# Altium project Kilobot_Controller.PrjPcb
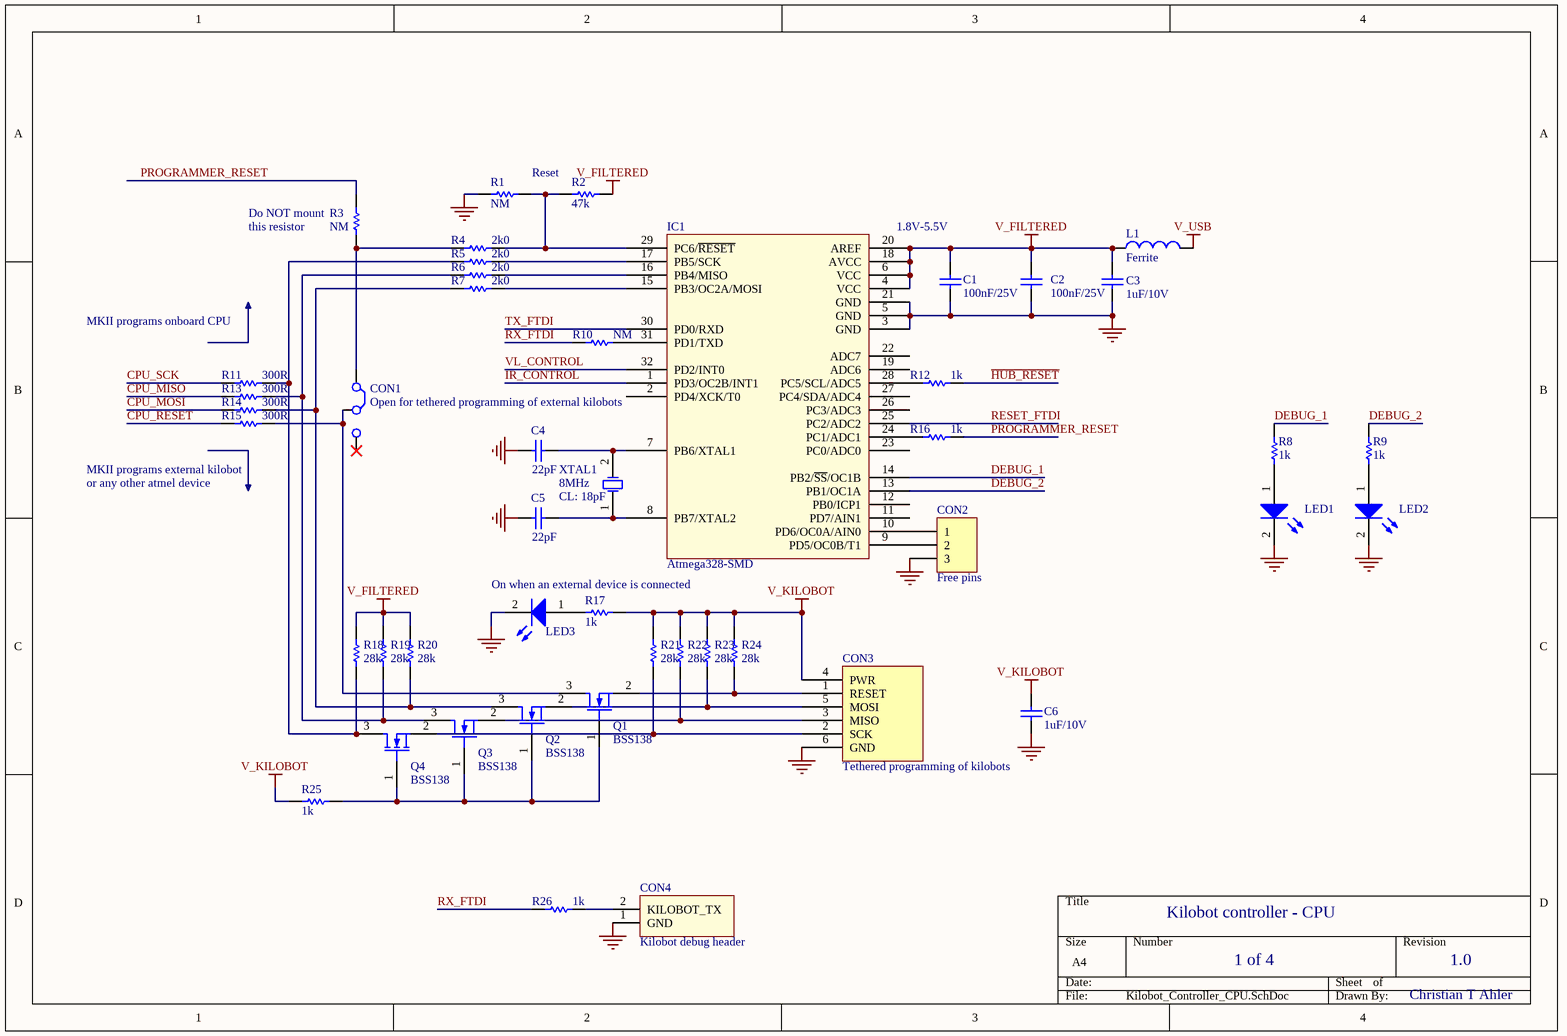
[diagram p0: Kilobot_Controller_CPU.SchDoc]
4 sheets, 142 parts. Net scope: global (net labels, ports and power ports of the same name join across sheets).
Board files: Kilobot_Controller_PCB.PcbDoc, Kilobot_Controller_PCB_Array.PcbDoc
Sheets:
  Kilobot_Controller_CPU.SchDoc
  Kilobot_Controller_IR.SchDoc
  Kilobot_Controller_ISP.SchDoc
  Kilobot_Controller_Hub&FTDI.SchDoc

## Sheet Kilobot_Controller_CPU.SchDoc
size A4; PageSetup: Record=PageOptions|CenterHorizontal=True|CenterVertical=True|PrintScale=1.00|XCorrection=1.00|YCorrection=1.00|PrintKind=1|BorderSize=5000000|LeftOffset=0|BottomOffset=0|Orientation=2|PaperLength=1000|PaperWidth=1000|Scale=100|PaperSource=15|PrintQuality=600|MediaType=1|DitherType=10|PaperKind=A4|PrintScaleMode=1

### Parts
C1  value 100nF/25V  [RESC1608L]  (hidden comment: C0603)
C2  value 100nF/25V  [RESC1608L]  (hidden comment: C0603)
C3  value 1uF/10V  [RESC1608L]  (hidden comment: C0603)
C4  value 22pF  [RESC1608L]  (hidden comment: C0603)
C5  value 22pF  [RESC1608L]  (hidden comment: C0603)
C6  value 1uF/10V  [RESC1608L]  (hidden comment: C0603)
CON1  (no value)  [HDR1X3]
CON2  Free pins  [HDR1X3]
CON3  Tethered programming of kilobots  [Programming]
CON4  Kilobot debug header  [HDR1X2]
IC1  Atmega328-SMD  [TQFP32]
L1  Ferrite  [RESC2012N]
LED1  LED  [LED0603]  (value not drawn)
LED2  LED  [LED0603]  (value not drawn)
LED3  LED  [LED0603]  (value not drawn)
Q1  value BSS138  [sot23-3]  (hidden comment: NMOS23)
Q2  value BSS138  [sot23-3]  (hidden comment: NMOS23)
Q3  value BSS138  [sot23-3]  (hidden comment: NMOS23)
Q4  value BSS138  [sot23-3]  (hidden comment: NMOS23)
R1  value NM  [RESC1608L]  (hidden comment: Res1)
R2  value 47k  [RESC1608L]  (hidden comment: Res1)
R3  value NM  [RESC1608L]  (hidden comment: Res1)
R4  value 2k0  [RESC1608L]  (hidden comment: Res1)
R5  value 2k0  [RESC1608L]  (hidden comment: Res1)
R6  value 2k0  [RESC1608L]  (hidden comment: Res1)
R7  value 2k0  [RESC1608L]  (hidden comment: Res1)
R8  value 1k  [RESC1608L]  (hidden comment: Res1)
R9  value 1k  [RESC1608L]  (hidden comment: Res1)
R10  value NM  [RESC1608L]  (hidden comment: Res1)
R11  value 300R  [RESC1608L]  (hidden comment: Res1)
R12  value 1k  [RESC1608L]  (hidden comment: Res1)
R13  value 300R  [RESC1608L]  (hidden comment: Res1)
R14  value 300R  [RESC1608L]  (hidden comment: Res1)
R15  value 300R  [RESC1608L]  (hidden comment: Res1)
R16  value 1k  [RESC1608L]  (hidden comment: Res1)
R17  value 1k  [RESC1608L]  (hidden comment: Res1)
R18  value 28k  [RESC1608L]  (hidden comment: Res1)
R19  value 28k  [RESC1608L]  (hidden comment: Res1)
R20  value 28k  [RESC1608L]  (hidden comment: Res1)
R21  value 28k  [RESC1608L]  (hidden comment: Res1)
R22  value 28k  [RESC1608L]  (hidden comment: Res1)
R23  value 28k  [RESC1608L]  (hidden comment: Res1)
R24  value 28k  [RESC1608L]  (hidden comment: Res1)
R25  value 1k  [RESC1608L]  (hidden comment: Res1)
R26  value 1k  [RESC1608L]  (hidden comment: Res1)
XTAL1  value 8MHz  CL: 18pF  [crystal-hc49]  (hidden comment: Crystal)

### Nets
GND: C1.2 C2.2 C3.1 C4.1 C5.1 C6.2 CON2.3 CON3.6(GND) CON4.1(GND) IC1.3(GND) IC1.5(GND) IC1.21(GND) LED1.2(K) LED2.2(K) LED3.2(K) R1.2
V_FILTERED: C1.1 C2.1 C3.2 IC1.4(VCC) IC1.6(VCC) IC1.18(AVCC) IC1.20(AREF) L1.1 R2.1 R18.2 R19.2 R20.2
V_KILOBOT: C6.1 CON3.4(PWR) R17.1 R21.2 R22.2 R23.2 R24.2 R25.1
V_USB: L1.2
CPU_MISO: R13.2
CPU_MOSI: R14.2
CPU_RESET: R15.2
CPU_SCK: R11.2
DEBUG_1: IC1.14(PB2/~{SS}/OC1B) R8.2
DEBUG_2: IC1.13(PB1/OC1A) R9.2
~{HUB_RESET}: R12.2
IR_CONTROL: IC1.1(PD3/OC2B/INT1)
PROGRAMMER_RESET: R3.2 R16.2
RESET_FTDI: IC1.25(PC2/ADC2)
RX_FTDI: R10.2 R26.2
TX_FTDI: IC1.30(PD0/RXD)
VL_CONTROL: IC1.32(PD2/INT0)
NetC4_2: C4.2 IC1.7(PB6/XTAL1) XTAL1.2(OSC2)
NetC5_2: C5.2 IC1.8(PB7/XTAL2) XTAL1.1(OSC1)
NetCON1_1: CON1.1(C1) R3.1 R4.2
NetCON1_2: CON1.2(C2) Q1.3(D) R15.1
NetCON2_1: CON2.1 IC1.10(PD6/OC0A/AIN0)
NetCON2_2: CON2.2 IC1.9(PD5/OC0B/T1)
NetCON3_1: CON3.1(RESET) Q1.2(S) R24.1
NetCON3_2: CON3.2(SCK) Q4.2(S) R21.1
NetCON3_3: CON3.3(MISO) Q3.2(S) R22.1
NetCON3_5: CON3.5(MOSI) Q2.2(S) R23.1
NetCON4_2: CON4.2(KILOBOT_TX) R26.1
NetIC1_15: IC1.15(PB3/OC2A/MOSI) R7.1
NetIC1_16: IC1.16(PB4/MISO) R6.1
NetIC1_17: IC1.17(PB5/SCK) R5.1
NetIC1_24: IC1.24(PC1/ADC1) R16.1
NetIC1_28: IC1.28(PC5/SCL/ADC5) R12.1
NetIC1_29: IC1.29(PC6/~{RESET}) R1.1 R2.2 R4.1
NetIC1_31: IC1.31(PD1/TXD) R10.1
NetLED1_1: LED1.1(A) R8.1
NetLED2_1: LED2.1(A) R9.1
NetLED3_1: LED3.1(A) R17.2
NetQ1_1: Q1.1(G) Q2.1(G) Q3.1(G) Q4.1(G) R25.2
NetQ2_3: Q2.3(D) R7.2 R14.1 R20.1
NetQ3_3: Q3.3(D) R6.2 R13.1 R19.1
NetQ4_3: Q4.3(D) R5.2 R11.1 R18.1

Not connected (* = marked no-connect by the designer): CON1 3(C3)*; IC1 2(PD4/XCK/T0) 11(PD7/AIN1) 12(PB0/ICP1) 19(ADC6) 22(ADC7) 23(PC0/ADC0) 26(PC3/ADC3) 27(PC4/SDA/ADC4)

### Notes on the sheet
- Reset
- (near R3) Do NOT mount
- (near R3) this resistor
- 1.8V-5.5V
- MKII programs onboard CPU
- (near IC1) Open for tethered programming of external kilobots
- MKII programs external kilobot
- or any other atmel device
- On when an external device is connected
- Kilobot controller - CPU
- 1 of 4
- 1.0
- Christian T Ahler

### Library data of the parts
C1 C2 = C0603: Ceramic Chip Capacitor - Standard; Order code: 445-1316-1-ND
C3 C6 = C0603: Ceramic Chip Capacitor - Standard; Order code: 445-1328-1-ND
C4 C5 = C0603: Ceramic Chip Capacitor - Standard; Order code: 445-1273-1-ND
CON1 = Jumper3: Value: Int/Ext programming; Order code: 3 pin jumper
CON2 = Header 3: Header, 3-Pin; Value: Free pins; Order code: Free pins
CON3 = Programming con new symbol: Value: Programming connector; Order code: 2x3 position pin header
CON4 = Kilobot_Debug_Header: Value: Debugging connector; Order code: 2 position pin header
IC1 = Atmega328-SMD: Order code: ATMEGA328-AU-ND; Value: Atmega328
L1 = Inductor: Value: 1k @ 100MHz; Order code: 445-5223-1-ND
LED1-LED3 = LED: Value: LED Green; Order code: 475-1409-1-ND
Q1-Q4 = NMOS23: Order code: BSS138KCT-ND
R1 R3 R10 = Res1: Resistor; Order code: DNO
R2 = Res1: Resistor; Order code: P47.0KHCT-ND
R4-R7 = Res1: Resistor; Order code: P2.0KGCT-ND
R8 R9 R12 R16 R17 R25 R26 = Res1: Resistor; Order code: P1.00KHCT-ND
R11 R13-R15 = Res1: Resistor; Order code: P300GCT-ND
R18-R24 = Res1: Resistor; Order code: P28.0KHCT-ND
XTAL1 = Crystal: Order code: 535-10212-1-ND

## Sheet Kilobot_Controller_IR.SchDoc
size A4
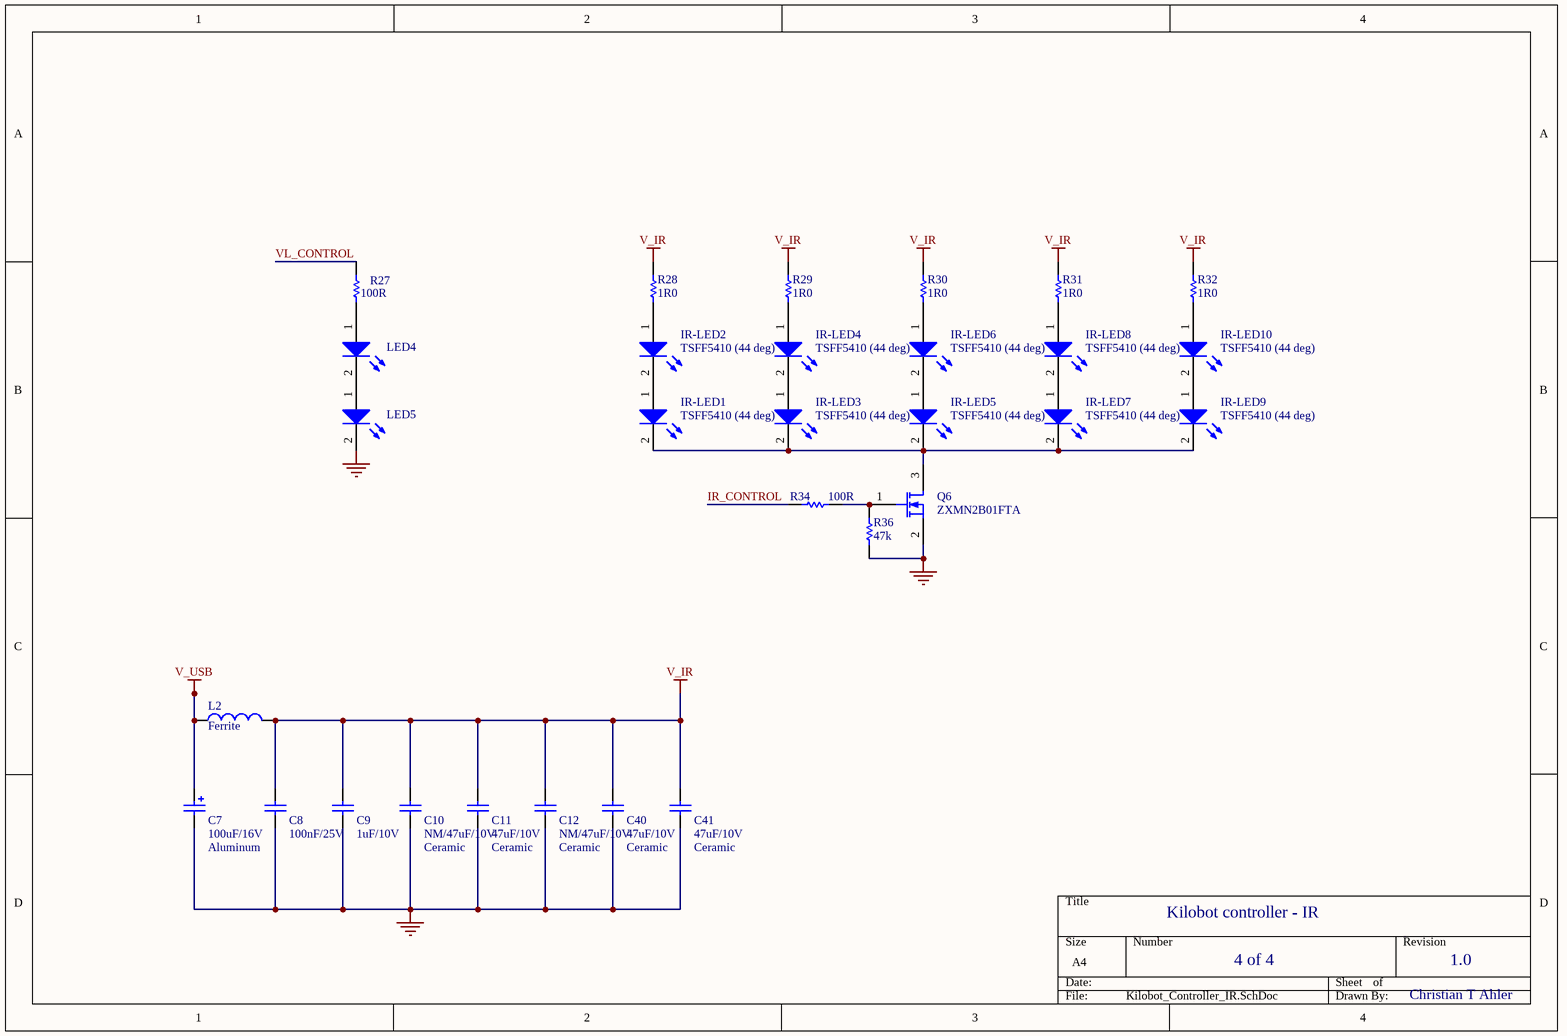
[diagram p1: Kilobot_Controller_IR.SchDoc]

### Parts
C7  Aluminum  value 100uF/16V  [cap5mm]
C8  value 100nF/25V  [RESC1608L]  (hidden comment: C0603)
C9  value 1uF/10V  [RESC1608L]  (hidden comment: C0603)
C10  Ceramic  value NM/47uF/10V  [8RB-1206]
C11  Ceramic  value 47uF/10V  [8RB-1206]
C12  Ceramic  value NM/47uF/10V  [8RB-1206]
C40  Ceramic  value 47uF/10V  [8RB-1206]
C41  Ceramic  value 47uF/10V  [8RB-1206]
IR-LED1  value TSFF5410 (44 deg)  [IR-LED]  (hidden comment: IR-LED)
IR-LED2  value TSFF5410 (44 deg)  [IR-LED]  (hidden comment: IR-LED)
IR-LED3  value TSFF5410 (44 deg)  [IR-LED]  (hidden comment: IR-LED)
IR-LED4  value TSFF5410 (44 deg)  [IR-LED]  (hidden comment: IR-LED)
IR-LED5  value TSFF5410 (44 deg)  [IR-LED]  (hidden comment: IR-LED)
IR-LED6  value TSFF5410 (44 deg)  [IR-LED]  (hidden comment: IR-LED)
IR-LED7  value TSFF5410 (44 deg)  [IR-LED]  (hidden comment: IR-LED)
IR-LED8  value TSFF5410 (44 deg)  [IR-LED]  (hidden comment: IR-LED)
IR-LED9  value TSFF5410 (44 deg)  [IR-LED]  (hidden comment: IR-LED)
IR-LED10  value TSFF5410 (44 deg)  [IR-LED]  (hidden comment: IR-LED)
L2  Ferrite  [RESC2012N]
LED4  LED  [LED0603]  (value not drawn)
LED5  LED  [LED0603]  (value not drawn)
Q6  value ZXMN2B01FTA  [sot23-3]  (hidden comment: NMOS23)
R27  value 100R  [RESC1608L]  (hidden comment: Res1)
R28  value 1R0  [RESC2012L]  (hidden comment: Res1)
R29  value 1R0  [RESC2012L]  (hidden comment: Res1)
R30  value 1R0  [RESC2012L]  (hidden comment: Res1)
R31  value 1R0  [RESC2012L]  (hidden comment: Res1)
R32  value 1R0  [RESC2012L]  (hidden comment: Res1)
R34  value 100R  [RESC1608L]  (hidden comment: Res1)
R36  value 47k  [RESC1608L]  (hidden comment: Res1)

### Nets
GND: C7.2 C8.2 C9.1 C10.1 C11.1 C12.1 C40.1 C41.1 LED5.2(K) Q6.2(S) R36.1
V_IR: C8.1 C9.2 C10.2 C11.2 C12.2 C40.2 C41.2 L2.2 R28.2 R29.2 R30.2 R31.2 R32.2
V_USB: C7.1 L2.1
IR_CONTROL: R34.2
VL_CONTROL: R27.2
NetIR-LED1_1: IR-LED1.1(A) IR-LED2.2(K)
NetIR-LED1_2: IR-LED1.2(K) IR-LED3.2(K) IR-LED5.2(K) IR-LED7.2(K) IR-LED9.2(K) Q6.3(D)
NetIR-LED2_1: IR-LED2.1(A) R28.1
NetIR-LED3_1: IR-LED3.1(A) IR-LED4.2(K)
NetIR-LED4_1: IR-LED4.1(A) R29.1
NetIR-LED5_1: IR-LED5.1(A) IR-LED6.2(K)
NetIR-LED6_1: IR-LED6.1(A) R30.1
NetIR-LED7_1: IR-LED7.1(A) IR-LED8.2(K)
NetIR-LED8_1: IR-LED8.1(A) R31.1
NetIR-LED9_1: IR-LED9.1(A) IR-LED10.2(K)
NetIR-LED10_1: IR-LED10.1(A) R32.1
NetLED4_1: LED4.1(A) R27.1
NetLED4_2: LED4.2(K) LED5.1(A)
NetQ6_1: Q6.1(G) R34.1 R36.2

### Notes on the sheet
- Kilobot controller - IR
- 4 of 4
- 1.0
- Christian T Ahler

### Library data of the parts
C7 = CAP: Order code: 493-1040-ND
C8 = C0603: as C1 on sheet Kilobot_Controller_CPU
C9 = C0603: as C3 on sheet Kilobot_Controller_CPU
C10 C12 = CAP2220: Order code: DNO
C11 C40 C41 = CAP2220: Order code: 490-3907-1-ND
IR-LED1-IR-LED10 = IR-LED: Order code: 751-1208-ND
L2 = Inductor: as L1 on sheet Kilobot_Controller_CPU
LED4 LED5 = LED: Value: LED Blue; Order code: LNJ937W8CRACT-ND
Q6 = NMOS23: Order code: ZXMN2B01FCT-ND; Alternative: SI2302ADS-T1-E3CT-ND
R27 R34 = Res1: Resistor; Order code: P100HCT-ND
R28-R32 = Res1: Resistor; Order code: RMCF0805JT1R00CT-ND
R36 = Res1: Resistor; Order code: P47.0KHCT-ND

## Sheet Kilobot_Controller_ISP.SchDoc
size A4
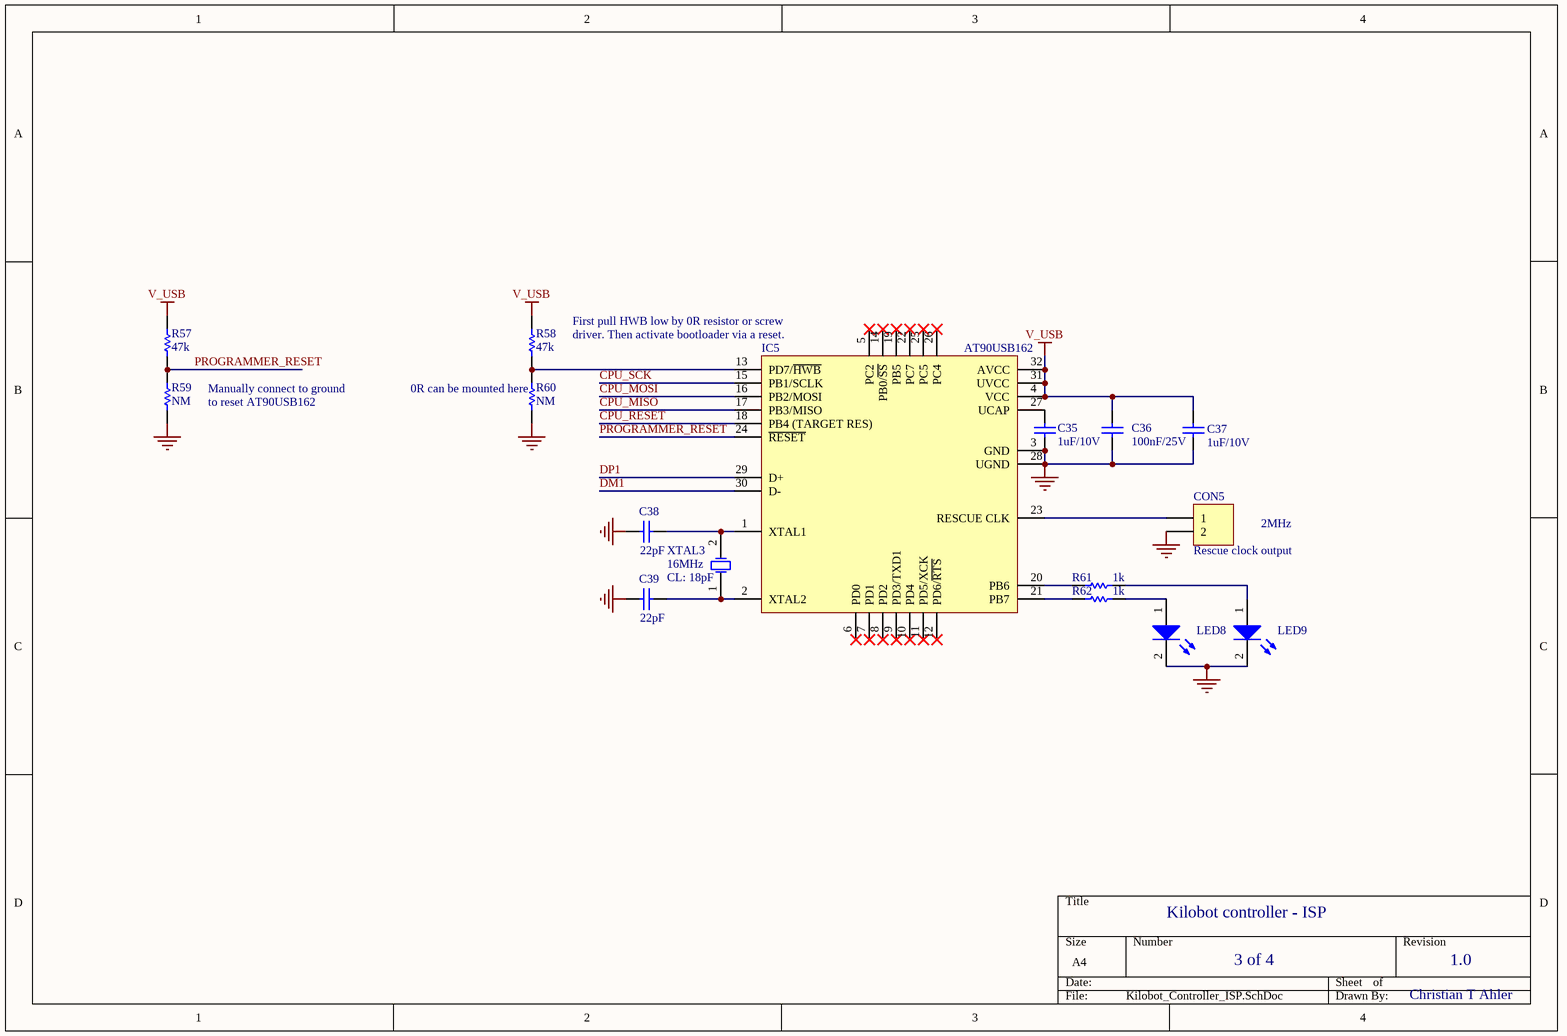
[diagram p2: Kilobot_Controller_ISP.SchDoc]

### Parts
C35  value 1uF/10V  [RESC1608L]  (hidden comment: C0603)
C36  value 100nF/25V  [RESC1608L]  (hidden comment: C0603)
C37  value 1uF/10V  [RESC1608L]  (hidden comment: C0603)
C38  value 22pF  [RESC1608L]  (hidden comment: C0603)
C39  value 22pF  [RESC1608L]  (hidden comment: C0603)
CON5  Rescue clock output  [HDR1X2]
IC5  AT90USB162  [TQFP32]
LED8  LED  [LED0603]  (value not drawn)
LED9  LED  [LED0603]  (value not drawn)
R57  value 47k  [RESC1608L]  (hidden comment: Res1)
R58  value 47k  [RESC1608L]  (hidden comment: Res1)
R59  value NM  [RESC1608L]  (hidden comment: Res1)
R60  value NM  [RESC1608L]  (hidden comment: Res1)
R61  value 1k  [RESC1608L]  (hidden comment: Res1)
R62  value 1k  [RESC1608L]  (hidden comment: Res1)
XTAL3  value 16MHz  CL: 18pF  [crystal-hc49]  (hidden comment: Crystal)

### Nets
GND: C35.1 C36.2 C37.1 C38.1 C39.1 CON5.2 IC5.3(GND) IC5.28(UGND) LED8.2(K) LED9.2(K) R59.2 R60.2
V_USB: C36.1 C37.2 IC5.4(VCC) IC5.31(UVCC) IC5.32(AVCC) R57.1 R58.1
CPU_MISO: IC5.17(PB3/MISO)
CPU_MOSI: IC5.16(PB2/MOSI)
CPU_RESET: IC5.18(PB4_(TARGET_RES))
CPU_SCK: IC5.15(PB1/SCLK)
DM1: IC5.30(D-)
DP1: IC5.29(D+)
PROGRAMMER_RESET: IC5.24(~{RESET}) R57.2 R59.1
NetC35_2: C35.2 IC5.27(UCAP)
NetC38_2: C38.2 IC5.1(XTAL1) XTAL3.2(OSC2)
NetC39_2: C39.2 IC5.2(XTAL2) XTAL3.1(OSC1)
NetCON5_1: CON5.1 IC5.23(RESCUE_CLK)
NetIC5_13: IC5.13(PD7/~{HWB}) R58.2 R60.1
NetIC5_20: IC5.20(PB6) R61.2
NetIC5_21: IC5.21(PB7) R62.2
NetLED8_1: LED8.1(A) R62.1
NetLED9_1: LED9.1(A) R61.1

Not connected (* = marked no-connect by the designer): IC5 5(PC2)* 6(PD0)* 7(PD1)* 8(PD2)* 9(PD3/TXD1)* 10(PD4)* 11(PD5/XCK)* 12(PD6/~{RTS})* 14(PB0/~{SS})* 19(PB5)* 22(PC7)* 25(PC5)* 26(PC4)*

### Notes on the sheet
- First pull HWB low by 0R resistor or screw
- (near IC5) driver. Then activate bootloader via a reset.
- Manually connect to ground
- to reset AT90USB162
- (near R60) 0R can be mounted here
- 2MHz
- Kilobot controller - ISP
- 3 of 4
- 1.0
- Christian T Ahler

### Library data of the parts
C35 C37 = C0603: as C3 on sheet Kilobot_Controller_CPU
C36 = C0603: as C1 on sheet Kilobot_Controller_CPU
C38 C39 = C0603: as C4 on sheet Kilobot_Controller_CPU
CON5 = Header 2: Header, 2-Pin; Order code: 2 position pin header; Value: Rescue clock output
IC5 = AT90USB162: Order code: AT90USB162-16AU-ND; Value: AT90USB162
LED8 LED9 = LED: as LED1 on sheet Kilobot_Controller_CPU
R57 R58 = Res1: Resistor; Order code: P47.0KHCT-ND
R59 R60 = Res1: Resistor; Order code: DNO
R61 R62 = Res1: Resistor; Order code: P1.00KHCT-ND
XTAL3 = Crystal: Order code: 535-10226-1-ND

## Sheet Kilobot_Controller_Hub&FTDI.SchDoc
size A4; PageSetup: Record=PageOptions|CenterHorizontal=True|CenterVertical=True|PrintScale=0.94|XCorrection=1.00|YCorrection=1.00|PrintKind=1|BorderSize=5000000|LeftOffset=0|BottomOffset=0|Orientation=2|PaperLength=1000|PaperWidth=1000|Scale=100|PaperSource=15|PrintQuality=600|MediaType=1|DitherType=10|PaperKind=Letter|PrintScaleMode=1
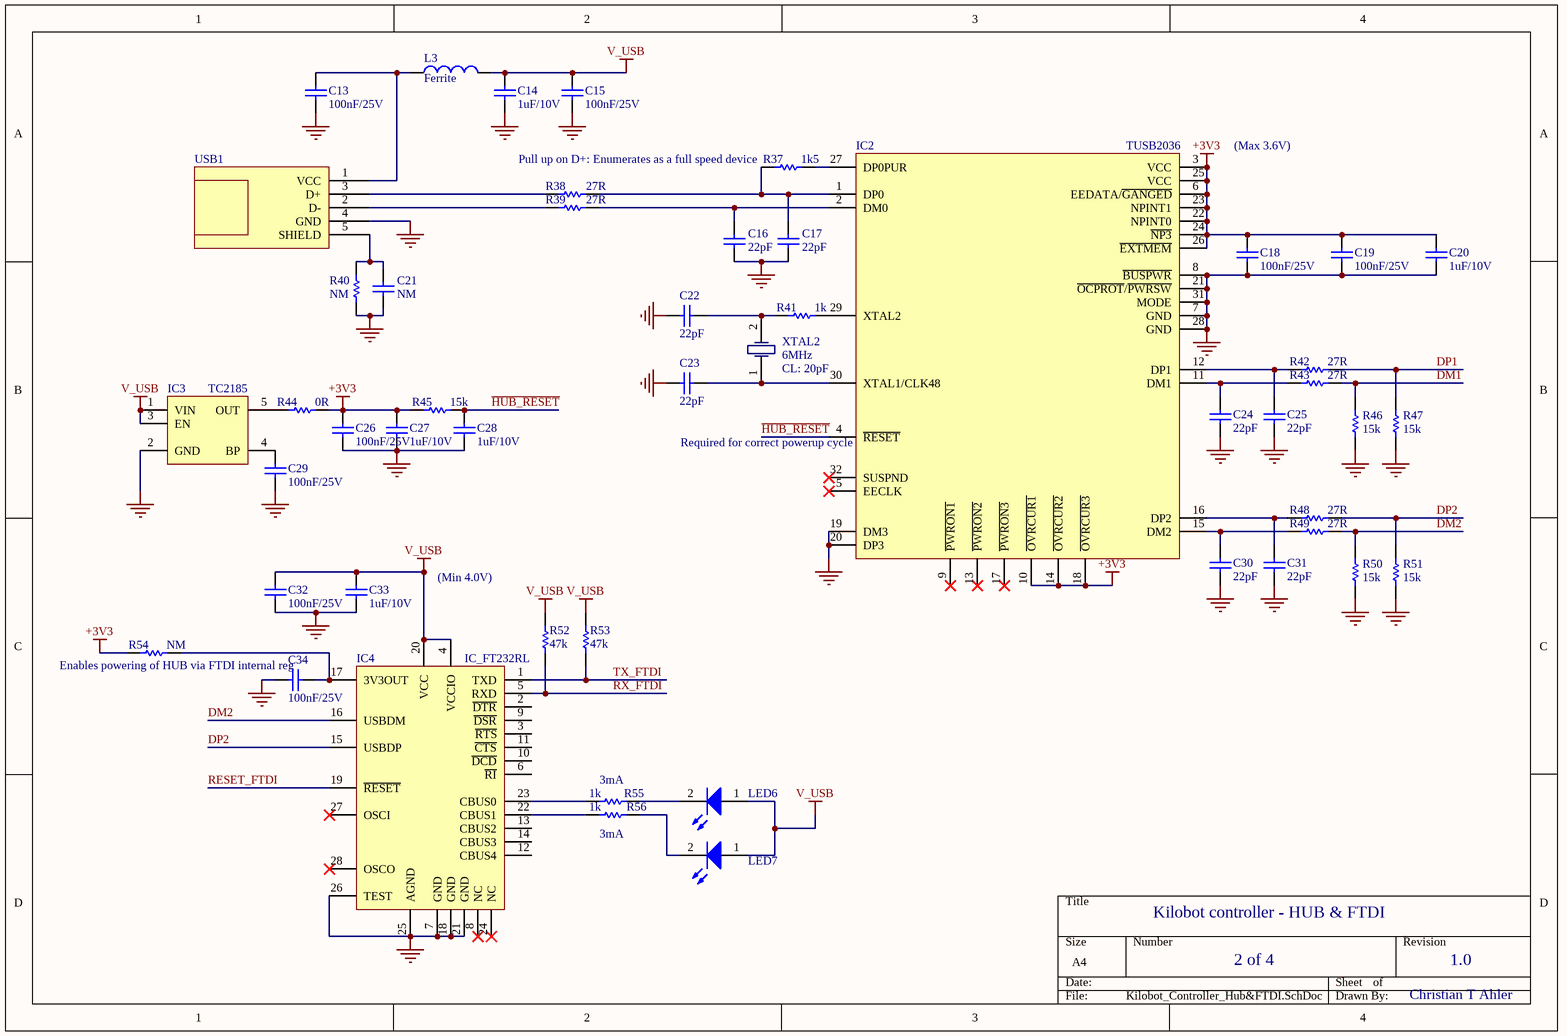
[diagram p3: Kilobot_Controller_Hub&FTDI.SchDoc]

### Parts
C13  value 100nF/25V  [RESC1608L]  (hidden comment: C0603)
C14  value 1uF/10V  [RESC1608L]  (hidden comment: C0603)
C15  value 100nF/25V  [RESC1608L]  (hidden comment: C0603)
C16  value 22pF  [RESC1608L]  (hidden comment: C0603)
C17  value 22pF  [RESC1608L]  (hidden comment: C0603)
C18  value 100nF/25V  [RESC1608L]  (hidden comment: C0603)
C19  value 100nF/25V  [RESC1608L]  (hidden comment: C0603)
C20  value 1uF/10V  [RESC1608L]  (hidden comment: C0603)
C21  value NM  [RESC1608L]  (hidden comment: C0603)
C22  value 22pF  [RESC1608L]  (hidden comment: C0603)
C23  value 22pF  [RESC1608L]  (hidden comment: C0603)
C24  value 22pF  [RESC1608L]  (hidden comment: C0603)
C25  value 22pF  [RESC1608L]  (hidden comment: C0603)
C26  value 100nF/25V  [RESC1608L]  (hidden comment: C0603)
C27  value 1uF/10V  [RESC1608L]  (hidden comment: C0603)
C28  value 1uF/10V  [RESC1608L]  (hidden comment: C0603)
C29  value 100nF/25V  [RESC1608L]  (hidden comment: C0603)
C30  value 22pF  [RESC1608L]  (hidden comment: C0603)
C31  value 22pF  [RESC1608L]  (hidden comment: C0603)
C32  value 100nF/25V  [RESC1608L]  (hidden comment: C0603)
C33  value 1uF/10V  [RESC1608L]  (hidden comment: C0603)
C34  value 100nF/25V  [RESC1608L]  (hidden comment: C0603)
IC2  TUSB2036  [TQFP32]
IC3  TC2185  [SOT23-5]
IC4  IC_FT232RL  [SSOP-28]
L3  Ferrite  [RESC2012N]
LED6  LED  [LED0603]  (value not drawn)
LED7  LED  [LED0603]  (value not drawn)
R37  value 1k5  [RESC1608L]  (hidden comment: Res1)
R38  value 27R  [RESC1608L]  (hidden comment: Res1)
R39  value 27R  [RESC1608L]  (hidden comment: Res1)
R40  value NM  [RESC1608L]  (hidden comment: Res1)
R41  value 1k  [RESC1608L]  (hidden comment: Res1)
R42  value 27R  [RESC1608L]  (hidden comment: Res1)
R43  value 27R  [RESC1608L]  (hidden comment: Res1)
R44  value 0R  [RESC1608L]  (hidden comment: Res1)
R45  value 15k  [RESC1608L]  (hidden comment: Res1)
R46  value 15k  [RESC1608L]  (hidden comment: Res1)
R47  value 15k  [RESC1608L]  (hidden comment: Res1)
R48  value 27R  [RESC1608L]  (hidden comment: Res1)
R49  value 27R  [RESC1608L]  (hidden comment: Res1)
R50  value 15k  [RESC1608L]  (hidden comment: Res1)
R51  value 15k  [RESC1608L]  (hidden comment: Res1)
R52  value 47k  [RESC1608L]  (hidden comment: Res1)
R53  value 47k  [RESC1608L]  (hidden comment: Res1)
R54  value NM  [RESC1608L]  (hidden comment: Res1)
R55  value 1k  [RESC1608L]  (hidden comment: Res1)
R56  value 1k  [RESC1608L]  (hidden comment: Res1)
USB1  USB  [USB_Vertical]  (value not drawn)
XTAL2  value 6MHz  CL: 20pF  [CrystalSMD]  (hidden comment: CrystalSMD)

### Nets
+3V3: C18.2 C19.2 C20.2 C26.2 C27.2 IC2.3(VCC) IC2.6(EEDATA/~{GANGED}) IC2.10(~{OVRCUR1}) IC2.14(~{OVRCUR2}) IC2.18(~{OVRCUR3}) IC2.22(NPINT0) IC2.23(NPINT1) IC2.24(~{NP3}) IC2.25(VCC) IC2.26(~{EXTMEM}) R44.1 R45.2 R54.2
GND: C13.1 C14.2 C15.1 C16.1 C17.1 C18.1 C19.1 C20.1 C21.2 C22.1 C23.1 C24.1 C25.1 C26.1 C27.1 C28.1 C29.2 C30.1 C31.1 C32.2 C33.1 C34.2 IC2.7(GND) IC2.8(~{BUSPWR}) IC2.19(DM3) IC2.20(DP3) IC2.21(~{OCPROT}/~{PWRSW}) IC2.28(GND) IC2.31(MODE) IC3.2(GND) IC4.7(GND) IC4.18(GND) IC4.21(GND) IC4.25(AGND) IC4.26(TEST) R40.2 R46.2 R47.2 R50.2 R51.2 USB1.4(GND)
V_USB: C14.1 C15.2 C32.1 C33.2 IC3.1(VIN) IC3.3(EN) IC4.4(VCCIO) IC4.20(VCC) L3.2 LED6.1(A) LED7.1(A) R52.2 R53.2
DM1: R43.1 R46.1
DM2: IC4.16(USBDM) R49.1 R50.1
DP1: R42.1 R47.1
DP2: IC4.15(USBDP) R48.1 R51.1
~{HUB_RESET}: C28.2 IC2.4(~{RESET}) R45.1
RESET_FTDI: IC4.19(~{RESET})
RX_FTDI: IC4.5(RXD) R52.1
TX_FTDI: IC4.1(TXD) R53.1
NetC13_2: C13.2 L3.1 USB1.1(VCC)
NetC16_2: C16.2 IC2.2(DM0) R39.1
NetC17_2: C17.2 IC2.1(DP0) R37.2 R38.1
NetC21_1: C21.1 R40.1 USB1.5(SHIELD)
NetC22_2: C22.2 R41.2 XTAL2.2
NetC23_2: C23.2 IC2.30(XTAL1/CLK48) XTAL2.1
NetC24_2: C24.2 IC2.11(DM1) R43.2
NetC25_2: C25.2 IC2.12(DP1) R42.2
NetC29_1: C29.1 IC3.4(BP)
NetC30_2: C30.2 IC2.15(DM2) R49.2
NetC31_2: C31.2 IC2.16(DP2) R48.2
NetC34_1: C34.1 IC4.17(3V3OUT) R54.1
NetIC2_27: IC2.27(DP0PUR) R37.1
NetIC2_29: IC2.29(XTAL2) R41.1
NetIC3_5: IC3.5(OUT) R44.2
NetIC4_22: IC4.22(CBUS1) R56.1
NetIC4_23: IC4.23(CBUS0) R55.1
NetLED6_2: LED6.2(K) R55.2
NetLED7_2: LED7.2(K) R56.2
NetR38_2: R38.2 USB1.3(D+)
NetR39_2: R39.2 USB1.2(D-)

Not connected (* = marked no-connect by the designer): IC2 5(EECLK)* 9(~{PWRON1})* 13(~{PWRON2})* 17(~{PWRON3})* 32(SUSPND)*; IC4 2(~{DTR}) 3(~{RTS}) 6(~{RI}) 8(NC)* 9(~{DSR}) 10(~{DCD}) 11(~{CTS}) 12(CBUS4) 13(CBUS2) 14(CBUS3) 24(NC)* 27(OSCI)* 28(OSCO)*

### Notes on the sheet
- (near R37) Pull up on D+: Enumerates as a full speed device
- (Max 3.6V)
- (near IC2) Required for correct powerup cycle
- (Min 4.0V)
- Enables powering of HUB via FTDI internal reg
- (near R55) 3mA
- (near R56) 3mA
- Kilobot controller - HUB & FTDI
- 2 of 4
- 1.0
- Christian T Ahler

### Library data of the parts
C13 C15 C18 C19 C26 C29 C32 C34 = C0603: as C1 on sheet Kilobot_Controller_CPU
C14 C20 C27 C28 C33 = C0603: as C3 on sheet Kilobot_Controller_CPU
C16 C17 C22-C25 C30 C31 = C0603: as C4 on sheet Kilobot_Controller_CPU
C21 = C0603: Ceramic Chip Capacitor - Standard; Order code: DNO
IC2 = TUSB2036: Order code: 296-27129-1-ND; Value: TUSB2036
IC3 = TC2185: Value: LDO; Order code: TC2185-3.3VCCT-ND
IC4 = IC_FT232RL: FT232R USB UART; Value: FTDI USB; Order code: 768-1007-1-ND
L3 = Inductor: as L1 on sheet Kilobot_Controller_CPU
LED6 LED7 = LED: as LED1 on sheet Kilobot_Controller_CPU
R37 = Res1: Resistor; Order code: P1.5KGCT-ND
R38 R39 R42 R43 R48 R49 = Res1: Resistor; Order code: P27GCT-ND
R40 R54 = Res1: Resistor; Order code: DNO
R41 R55 R56 = Res1: Resistor; Order code: P1.00KHCT-ND
R44 = Res1: Resistor; Order code: RMCF0603ZT0R00CT-ND
R45-R47 R50 R51 = Res1: Resistor; Order code: P15KGCT-ND
R52 R53 = Res1: Resistor; Order code: P47.0KHCT-ND
USB1 = USB: Value: USB Connector; Order code: 151-1083-ND
XTAL2 = CrystalSMD: Order code: XC1000CT-ND

## Nets that join several sheets
GND: Kilobot_Controller_CPU (16 pins), Kilobot_Controller_IR (11 pins), Kilobot_Controller_ISP (12 pins), Kilobot_Controller_Hub&FTDI (41 pins)
V_USB: Kilobot_Controller_CPU (L1.2), Kilobot_Controller_IR (C7.1 L2.1), Kilobot_Controller_ISP (7 pins), Kilobot_Controller_Hub&FTDI (13 pins)
CPU_MISO: Kilobot_Controller_CPU (R13.2), Kilobot_Controller_ISP (IC5.17)
CPU_MOSI: Kilobot_Controller_CPU (R14.2), Kilobot_Controller_ISP (IC5.16)
CPU_RESET: Kilobot_Controller_CPU (R15.2), Kilobot_Controller_ISP (IC5.18)
CPU_SCK: Kilobot_Controller_CPU (R11.2), Kilobot_Controller_ISP (IC5.15)
DM1: Kilobot_Controller_ISP (IC5.30), Kilobot_Controller_Hub&FTDI (R43.1 R46.1)
DP1: Kilobot_Controller_ISP (IC5.29), Kilobot_Controller_Hub&FTDI (R42.1 R47.1)
~{HUB_RESET}: Kilobot_Controller_CPU (R12.2), Kilobot_Controller_Hub&FTDI (C28.2 IC2.4 R45.1)
IR_CONTROL: Kilobot_Controller_CPU (IC1.1), Kilobot_Controller_IR (R34.2)
PROGRAMMER_RESET: Kilobot_Controller_CPU (R3.2 R16.2), Kilobot_Controller_ISP (IC5.24 R57.2 R59.1)
RESET_FTDI: Kilobot_Controller_CPU (IC1.25), Kilobot_Controller_Hub&FTDI (IC4.19)
RX_FTDI: Kilobot_Controller_CPU (R10.2 R26.2), Kilobot_Controller_Hub&FTDI (IC4.5 R52.1)
TX_FTDI: Kilobot_Controller_CPU (IC1.30), Kilobot_Controller_Hub&FTDI (IC4.1 R53.1)
VL_CONTROL: Kilobot_Controller_CPU (IC1.32), Kilobot_Controller_IR (R27.2)